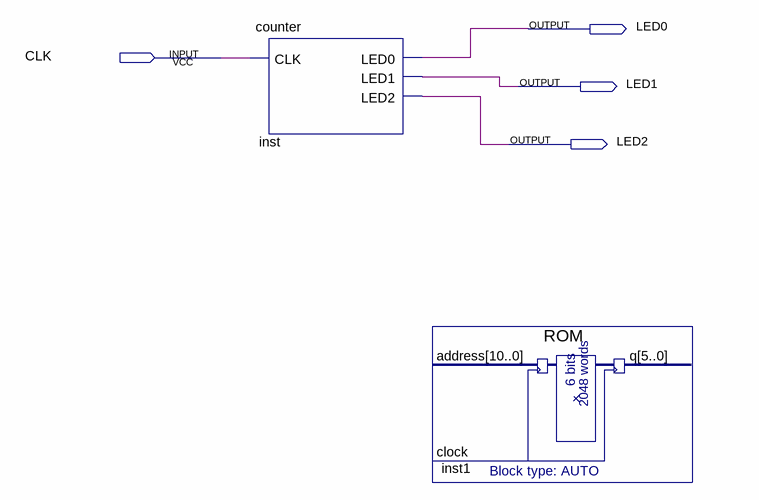
[diagram p0: schematic sheet]
// Quartus schematic Block.bdf as structural Verilog: 2 symbols, 4 pins
module Block (
  input  CLK,
  output LED0,
  output LED1,
  output LED2
);

  counter inst (.CLK(CLK), .LED0(LED0), .LED1(LED1), .LED2(LED2));
  ROM inst1 ();  // open: address, clock, q
endmodule
